# EAGLE schematic It's Time, Do (EAGLE 9.6.2)
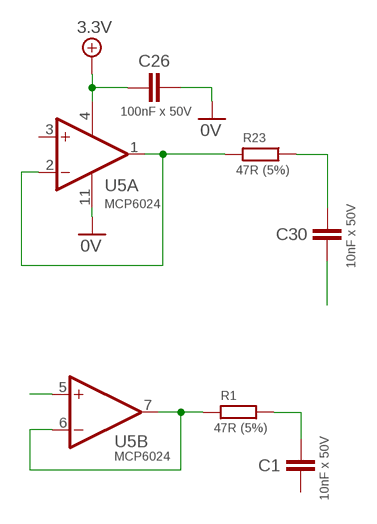
[diagram p0: schematic, sheet 1]

## Parts
C1  10nF x 50V  C_0603  [C0603]
C26  100nF x 50V  C_0603  [C0603]
C30  10nF x 50V  C_0603  [C0603]
R1  47R (5%)  R_0603  [R0603]
R23  47R (5%)  R_0603  [R0603]
U5  MCP6024  [14-SOIC]

## Nets
0V: C26.1 C30.2 U5.11(V-)
3.3V: C26.2 U5.4(V+)
N$1: C30.1 R23.1
N$2: U5.5(B:+IN)
N$3: R1.2 U5.6(B:-IN) U5.7(B:OUT)
N$4: C1.1 R1.1
N$15: R23.2 U5.1(A:OUT) U5.2(A:-IN)
Unconnected: C1.2 U5.3(A:+IN) U5.8(C:OUT) U5.9(C:-IN) U5.10(C:+IN) U5.12(D:+IN) U5.13(D:-IN) U5.14(D:OUT)

## Library data of the parts
C1 C30 = My-RLC:C_: NON-POLARIZED CAP; PN: C0603C103M5RACTU
C26 = My-RLC:C_: NON-POLARIZED CAP; PN: C0603C104M5RACTU
R1 R23 = My-RLC:R_: RESISTOR; PN: RC0603JR-0747RL
U5 = MCP6024:MCP6024; AVAILABILITY: Unavailable; DESCRIPTION: General Purpose Amplifier 4 Circuit Rail-to-Rail 14-SOIC; MF: Microchip; MP: MCP6024-I/SL; PACKAGE: SOIC-14 Microchip; PN: MCP6024-I/SL; PRICE: None